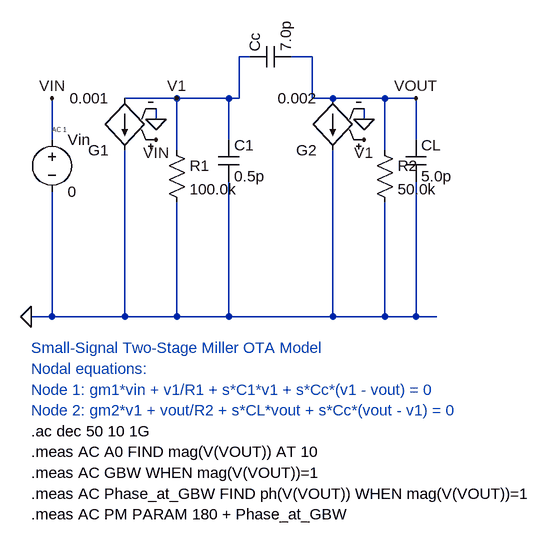
[diagram p0: schematic small_signal_ota.asc]
small_signal_ota.asc, the LTspice schematic file:
Version 4
SHEET 1 1400 900
WIRE 80 512 704 512
WIRE 112 176 112 240
WIRE 112 320 112 512
WIRE 224 176 400 176
WIRE 224 256 224 512
WIRE 272 192 272 208
WIRE 304 176 304 256
WIRE 304 336 304 512
WIRE 384 176 384 240
WIRE 384 304 384 512
WIRE 400 176 400 112
WIRE 400 112 416 112
WIRE 480 112 512 112
WIRE 512 112 512 176
WIRE 512 176 672 176
WIRE 544 256 544 512
WIRE 592 192 592 208
WIRE 624 176 624 256
WIRE 624 336 624 512
WIRE 672 176 672 240
WIRE 672 304 672 512
FLAG 80 512 0
FLAG 112 176 VIN
FLAG 304 176 V1
FLAG 272 240 VIN
FLAG 272 208 0
FLAG 672 176 VOUT
FLAG 592 240 V1
FLAG 592 208 0
SYMBOL voltage 112 224 R0
WINDOW 123 0 0 Left 0
WINDOW 39 0 0 Left 0
SYMATTR InstName Vin
SYMATTR Value 0
SYMATTR Value2 AC 1
SYMBOL g 224 272 R180
WINDOW 123 0 0 Left 0
WINDOW 39 0 0 Left 0
SYMATTR InstName G1
SYMATTR Value 0.001
SYMBOL res 288 240 R0
WINDOW 123 0 0 Left 0
WINDOW 39 0 0 Left 0
SYMATTR InstName R1
SYMATTR Value 100.0k
SYMBOL cap 368 240 R0
WINDOW 123 0 0 Left 0
WINDOW 39 0 0 Left 0
SYMATTR InstName C1
SYMATTR Value 0.5p
SYMBOL cap 416 128 R270
WINDOW 123 0 0 Left 0
WINDOW 39 0 0 Left 0
SYMATTR InstName Cc
SYMATTR Value 7.0p
SYMBOL g 544 272 R180
WINDOW 123 0 0 Left 0
WINDOW 39 0 0 Left 0
SYMATTR InstName G2
SYMATTR Value 0.002
SYMBOL res 608 240 R0
WINDOW 123 0 0 Left 0
WINDOW 39 0 0 Left 0
SYMATTR InstName R2
SYMATTR Value 50.0k
SYMBOL cap 656 240 R0
WINDOW 123 0 0 Left 0
WINDOW 39 0 0 Left 0
SYMATTR InstName CL
SYMATTR Value 5.0p
TEXT 80 560 Left 2 ;Small-Signal Two-Stage Miller OTA Model
TEXT 80 592 Left 2 ;Nodal equations:
TEXT 80 624 Left 2 ;Node 1: gm1*vin + v1/R1 + s*C1*v1 + s*Cc*(v1 - vout) = 0
TEXT 80 656 Left 2 ;Node 2: gm2*v1 + vout/R2 + s*CL*vout + s*Cc*(vout - v1) = 0
TEXT 80 688 Left 2 !.ac dec 50 10 1G
TEXT 80 720 Left 2 !.meas AC A0 FIND mag(V(VOUT)) AT 10
TEXT 80 752 Left 2 !.meas AC GBW WHEN mag(V(VOUT))=1
TEXT 80 784 Left 2 !.meas AC Phase_at_GBW FIND ph(V(VOUT)) WHEN mag(V(VOUT))=1
TEXT 80 816 Left 2 !.meas AC PM PARAM 180 + Phase_at_GBW

The netlist it stands for:
* small_signal_ota.asc
Vin VIN 0 0 AC 1
G1 V1 0 VIN 0 0.001
R1 V1 0 100.0k
C1 V1 0 0.5p
Cc V1 VOUT 7.0p
G2 VOUT 0 V1 0 0.002
R2 VOUT 0 50.0k
CL VOUT 0 5.0p
* Small-Signal Two-Stage Miller OTA Model
* Nodal equations:
* Node 1: gm1*vin + v1/R1 + s*C1*v1 + s*Cc*(v1 - vout) = 0
* Node 2: gm2*v1 + vout/R2 + s*CL*vout + s*Cc*(vout - v1) = 0
.ac dec 50 10 1G
.meas AC A0 FIND mag(V(VOUT)) AT 10
.meas AC GBW WHEN mag(V(VOUT))=1
.meas AC Phase_at_GBW FIND ph(V(VOUT)) WHEN mag(V(VOUT))=1
.meas AC PM PARAM 180 + Phase_at_GBW
.backanno
.end